# Altium schematic sheet scheme.SchDoc
size A0; Organization: Altium Limited; Address1: L3, 12a Rodborough Rd; Address2: Frenchs Forest; Address3: NSW; Address4: Australia 2086
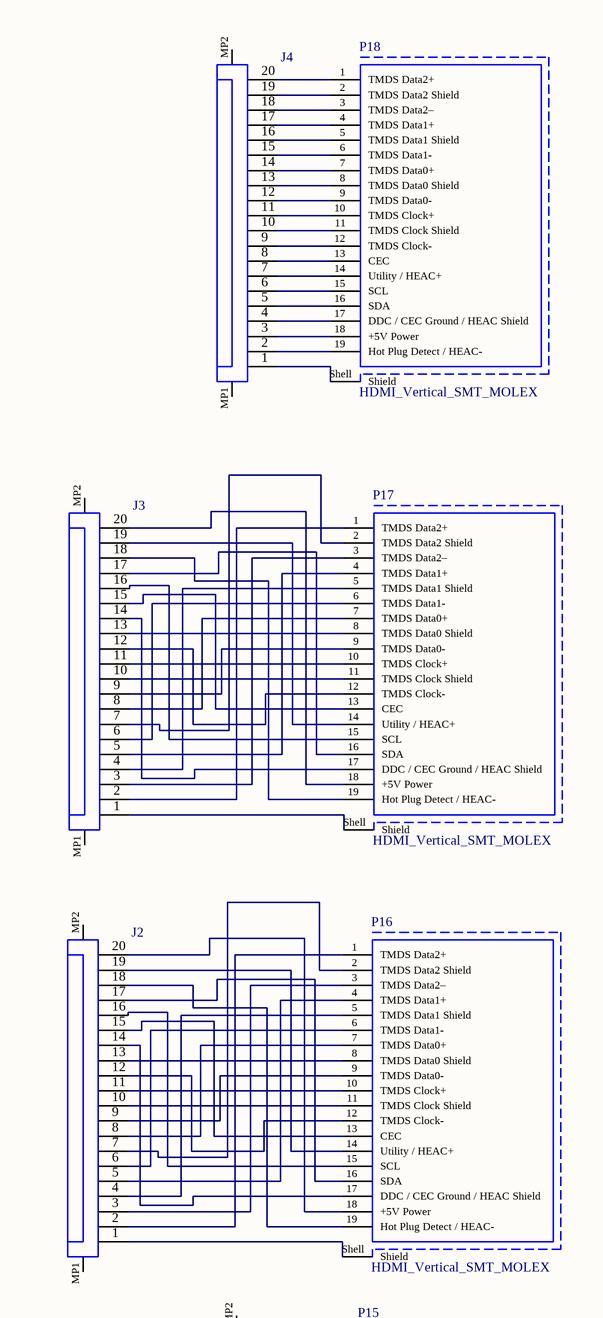
[diagram p0: scheme.SchDoc, top]
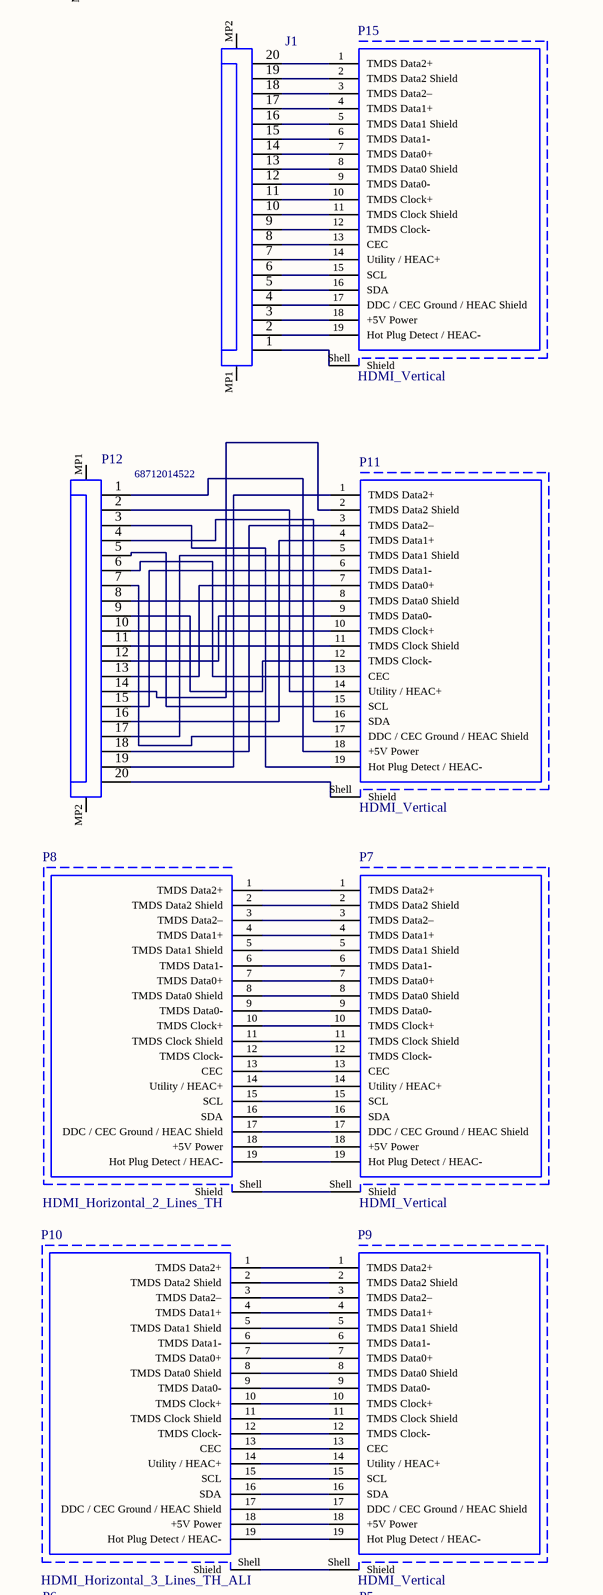
[diagram p1: scheme.SchDoc, centre]
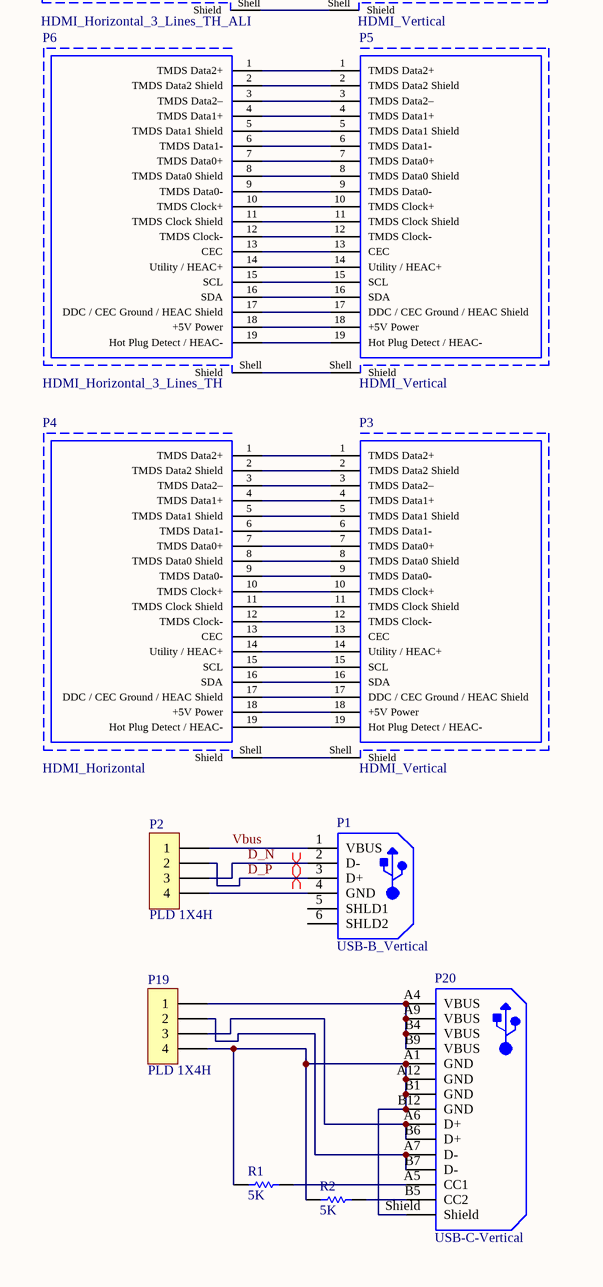
[diagram p2: scheme.SchDoc, bottom]

## Parts
J1  68712014522  [FFC_20pin_0.5mm]  (value not drawn)
J2  68712014522  [FFC_20pin_0.5mm]  (value not drawn)
J3  68712014522  [FFC_20pin_0.5mm]  (value not drawn)
J4  68712014522  [FFC_20pin_0.5mm]  (value not drawn)
P1  USB-B_Vertical  [USB-B_Vertical]
P2  PLD 1X4H  [PLD 1X4H]
P3  HDMI_Vertical  [HDMI Vertical]
P4  HDMI_Horizontal  [HDMI HORIZONTAL]
P5  HDMI_Vertical  [HDMI Vertical]
P6  HDMI_Horizontal_3_Lines_TH  [HDMI HORIZONTAL 3 LINES TH]
P7  HDMI_Vertical  [HDMI Vertical]
P8  HDMI_Horizontal_2_Lines_TH  [HDMI HORIZONTAL 2 LINES TH]
P9  HDMI_Vertical  [HDMI Vertical]
P10  HDMI_Horizontal_3_Lines_TH_ALI  [HDMI HORIZONTAL 3 LINES TH ALI]
P11  HDMI_Vertical  [HDMI Vertical]
P12  68712014522  [68712014522]
P15  HDMI_Vertical  [HDMI Vertical]
P16  HDMI_Vertical_SMT_MOLEX  [HDMI VERTICAL SMT]
P17  HDMI_Vertical_SMT_MOLEX  [HDMI VERTICAL SMT]
P18  HDMI_Vertical_SMT_MOLEX  [HDMI VERTICAL SMT]
P19  PLD 1X4H  [PLD 1X4H]
P20  USB-C-Vertical  [USB-C]
R1  5K  [1206]
R2  5K  [1206]

## Nets
D_N: P1.2(D-) P2.3
D_P: P1.3(D+) P2.2
Vbus: P1.1(VBUS) P2.1
NetJ1_1: J1.1 P15.Shell(Shield)
NetJ1_2: J1.2 P15.19(Hot_Plug_Detect_/_HEAC-)
NetJ1_3: J1.3 P15.18(+5V_Power)
NetJ1_4: J1.4 P15.17(DDC_/_CEC_Ground_/_HEAC_Shield)
NetJ1_5: J1.5 P15.16(SDA)
NetJ1_6: J1.6 P15.15(SCL)
NetJ1_7: J1.7 P15.14(Utility_/_HEAC+)
NetJ1_8: J1.8 P15.13(CEC)
NetJ1_9: J1.9 P15.12(TMDS_Clock-)
NetJ1_10: J1.10 P15.11(TMDS_Clock_Shield)
NetJ1_11: J1.11 P15.10(TMDS_Clock+)
NetJ1_12: J1.12 P15.9(TMDS_Data0-)
NetJ1_13: J1.13 P15.8(TMDS_Data0_Shield)
NetJ1_14: J1.14 P15.7(TMDS_Data0+)
NetJ1_15: J1.15 P15.6(TMDS_Data1-)
NetJ1_16: J1.16 P15.5(TMDS_Data1_Shield)
NetJ1_17: J1.17 P15.4(TMDS_Data1+)
NetJ1_18: J1.18 P15.3(TMDS_Data2–)
NetJ1_19: J1.19 P15.2(TMDS_Data2_Shield)
NetJ1_20: J1.20 P15.1(TMDS_Data2+)
NetJ2_1: J2.1 P16.Shell(Shield)
NetJ2_2: J2.2 P16.1(TMDS_Data2+)
NetJ2_3: J2.3 P16.3(TMDS_Data2–)
NetJ2_4: J2.4 P16.5(TMDS_Data1_Shield)
NetJ2_5: J2.5 P16.4(TMDS_Data1+)
NetJ2_6: J2.6 P16.6(TMDS_Data1-)
NetJ2_7: J2.7 P16.2(TMDS_Data2_Shield)
NetJ2_8: J2.8 P16.7(TMDS_Data0+)
NetJ2_9: J2.9 P16.9(TMDS_Data0-)
NetJ2_10: J2.10 P16.11(TMDS_Clock_Shield)
NetJ2_11: J2.11 P16.10(TMDS_Clock+)
NetJ2_12: J2.12 P16.12(TMDS_Clock-)
NetJ2_13: J2.13 P16.8(TMDS_Data0_Shield)
NetJ2_14: J2.14 P16.17(DDC_/_CEC_Ground_/_HEAC_Shield)
NetJ2_15: J2.15 P16.13(CEC)
NetJ2_16: J2.16 P16.15(SCL)
NetJ2_17: J2.17 P16.16(SDA)
NetJ2_18: J2.18 P16.19(Hot_Plug_Detect_/_HEAC-)
NetJ2_19: J2.19 P16.14(Utility_/_HEAC+)
NetJ2_20: J2.20 P16.18(+5V_Power)
NetJ3_1: J3.1 P17.Shell(Shield)
NetJ3_2: J3.2 P17.1(TMDS_Data2+)
NetJ3_3: J3.3 P17.3(TMDS_Data2–)
NetJ3_4: J3.4 P17.5(TMDS_Data1_Shield)
NetJ3_5: J3.5 P17.4(TMDS_Data1+)
NetJ3_6: J3.6 P17.6(TMDS_Data1-)
NetJ3_7: J3.7 P17.2(TMDS_Data2_Shield)
NetJ3_8: J3.8 P17.7(TMDS_Data0+)
NetJ3_9: J3.9 P17.9(TMDS_Data0-)
NetJ3_10: J3.10 P17.11(TMDS_Clock_Shield)
NetJ3_11: J3.11 P17.10(TMDS_Clock+)
NetJ3_12: J3.12 P17.12(TMDS_Clock-)
NetJ3_13: J3.13 P17.8(TMDS_Data0_Shield)
NetJ3_14: J3.14 P17.17(DDC_/_CEC_Ground_/_HEAC_Shield)
NetJ3_15: J3.15 P17.13(CEC)
NetJ3_16: J3.16 P17.15(SCL)
NetJ3_17: J3.17 P17.16(SDA)
NetJ3_18: J3.18 P17.19(Hot_Plug_Detect_/_HEAC-)
NetJ3_19: J3.19 P17.14(Utility_/_HEAC+)
NetJ3_20: J3.20 P17.18(+5V_Power)
NetJ4_1: J4.1 P18.Shell(Shield)
NetJ4_2: J4.2 P18.19(Hot_Plug_Detect_/_HEAC-)
NetJ4_3: J4.3 P18.18(+5V_Power)
NetJ4_4: J4.4 P18.17(DDC_/_CEC_Ground_/_HEAC_Shield)
NetJ4_5: J4.5 P18.16(SDA)
NetJ4_6: J4.6 P18.15(SCL)
NetJ4_7: J4.7 P18.14(Utility_/_HEAC+)
NetJ4_8: J4.8 P18.13(CEC)
NetJ4_9: J4.9 P18.12(TMDS_Clock-)
NetJ4_10: J4.10 P18.11(TMDS_Clock_Shield)
NetJ4_11: J4.11 P18.10(TMDS_Clock+)
NetJ4_12: J4.12 P18.9(TMDS_Data0-)
NetJ4_13: J4.13 P18.8(TMDS_Data0_Shield)
NetJ4_14: J4.14 P18.7(TMDS_Data0+)
NetJ4_15: J4.15 P18.6(TMDS_Data1-)
NetJ4_16: J4.16 P18.5(TMDS_Data1_Shield)
NetJ4_17: J4.17 P18.4(TMDS_Data1+)
NetJ4_18: J4.18 P18.3(TMDS_Data2–)
NetJ4_19: J4.19 P18.2(TMDS_Data2_Shield)
NetJ4_20: J4.20 P18.1(TMDS_Data2+)
NetP1_4: P1.4(GND) P2.4
NetP3_1: P3.1(TMDS_Data2+) P4.1(TMDS_Data2+)
NetP3_2: P3.2(TMDS_Data2_Shield) P4.2(TMDS_Data2_Shield)
NetP3_3: P3.3(TMDS_Data2–) P4.3(TMDS_Data2–)
NetP3_4: P3.4(TMDS_Data1+) P4.4(TMDS_Data1+)
NetP3_5: P3.5(TMDS_Data1_Shield) P4.5(TMDS_Data1_Shield)
NetP3_6: P3.6(TMDS_Data1-) P4.6(TMDS_Data1-)
NetP3_7: P3.7(TMDS_Data0+) P4.7(TMDS_Data0+)
NetP3_8: P3.8(TMDS_Data0_Shield) P4.8(TMDS_Data0_Shield)
NetP3_9: P3.9(TMDS_Data0-) P4.9(TMDS_Data0-)
NetP3_10: P3.10(TMDS_Clock+) P4.10(TMDS_Clock+)
NetP3_11: P3.11(TMDS_Clock_Shield) P4.11(TMDS_Clock_Shield)
NetP3_12: P3.12(TMDS_Clock-) P4.12(TMDS_Clock-)
NetP3_13: P3.13(CEC) P4.13(CEC)
NetP3_14: P3.14(Utility_/_HEAC+) P4.14(Utility_/_HEAC+)
NetP3_15: P3.15(SCL) P4.15(SCL)
NetP3_16: P3.16(SDA) P4.16(SDA)
NetP3_17: P3.17(DDC_/_CEC_Ground_/_HEAC_Shield) P4.17(DDC_/_CEC_Ground_/_HEAC_Shield)
NetP3_18: P3.18(+5V_Power) P4.18(+5V_Power)
NetP3_19: P3.19(Hot_Plug_Detect_/_HEAC-) P4.19(Hot_Plug_Detect_/_HEAC-)
NetP3_Shell: P3.Shell(Shield) P4.Shell(Shield)
NetP5_1: P5.1(TMDS_Data2+) P6.1(TMDS_Data2+)
NetP5_2: P5.2(TMDS_Data2_Shield) P6.2(TMDS_Data2_Shield)
NetP5_3: P5.3(TMDS_Data2–) P6.3(TMDS_Data2–)
NetP5_4: P5.4(TMDS_Data1+) P6.4(TMDS_Data1+)
NetP5_5: P5.5(TMDS_Data1_Shield) P6.5(TMDS_Data1_Shield)
NetP5_6: P5.6(TMDS_Data1-) P6.6(TMDS_Data1-)
NetP5_7: P5.7(TMDS_Data0+) P6.7(TMDS_Data0+)
NetP5_8: P5.8(TMDS_Data0_Shield) P6.8(TMDS_Data0_Shield)
NetP5_9: P5.9(TMDS_Data0-) P6.9(TMDS_Data0-)
NetP5_10: P5.10(TMDS_Clock+) P6.10(TMDS_Clock+)
NetP5_11: P5.11(TMDS_Clock_Shield) P6.11(TMDS_Clock_Shield)
NetP5_12: P5.12(TMDS_Clock-) P6.12(TMDS_Clock-)
NetP5_13: P5.13(CEC) P6.13(CEC)
NetP5_14: P5.14(Utility_/_HEAC+) P6.14(Utility_/_HEAC+)
NetP5_15: P5.15(SCL) P6.15(SCL)
NetP5_16: P5.16(SDA) P6.16(SDA)
NetP5_17: P5.17(DDC_/_CEC_Ground_/_HEAC_Shield) P6.17(DDC_/_CEC_Ground_/_HEAC_Shield)
NetP5_18: P5.18(+5V_Power) P6.18(+5V_Power)
NetP5_19: P5.19(Hot_Plug_Detect_/_HEAC-) P6.19(Hot_Plug_Detect_/_HEAC-)
NetP5_Shell: P5.Shell(Shield) P6.Shell(Shield)
NetP7_1: P7.1(TMDS_Data2+) P8.1(TMDS_Data2+)
NetP7_2: P7.2(TMDS_Data2_Shield) P8.2(TMDS_Data2_Shield)
NetP7_3: P7.3(TMDS_Data2–) P8.3(TMDS_Data2–)
NetP7_4: P7.4(TMDS_Data1+) P8.4(TMDS_Data1+)
NetP7_5: P7.5(TMDS_Data1_Shield) P8.5(TMDS_Data1_Shield)
NetP7_6: P7.6(TMDS_Data1-) P8.6(TMDS_Data1-)
NetP7_7: P7.7(TMDS_Data0+) P8.7(TMDS_Data0+)
NetP7_8: P7.8(TMDS_Data0_Shield) P8.8(TMDS_Data0_Shield)
NetP7_9: P7.9(TMDS_Data0-) P8.9(TMDS_Data0-)
NetP7_10: P7.10(TMDS_Clock+) P8.10(TMDS_Clock+)
NetP7_11: P7.11(TMDS_Clock_Shield) P8.11(TMDS_Clock_Shield)
NetP7_12: P7.12(TMDS_Clock-) P8.12(TMDS_Clock-)
NetP7_13: P7.13(CEC) P8.13(CEC)
NetP7_14: P7.14(Utility_/_HEAC+) P8.14(Utility_/_HEAC+)
NetP7_15: P7.15(SCL) P8.15(SCL)
NetP7_16: P7.16(SDA) P8.16(SDA)
NetP7_17: P7.17(DDC_/_CEC_Ground_/_HEAC_Shield) P8.17(DDC_/_CEC_Ground_/_HEAC_Shield)
NetP7_18: P7.18(+5V_Power) P8.18(+5V_Power)
NetP7_19: P7.19(Hot_Plug_Detect_/_HEAC-) P8.19(Hot_Plug_Detect_/_HEAC-)
NetP7_Shell: P7.Shell(Shield) P8.Shell(Shield)
NetP9_1: P9.1(TMDS_Data2+) P10.1(TMDS_Data2+)
NetP9_2: P9.2(TMDS_Data2_Shield) P10.2(TMDS_Data2_Shield)
NetP9_3: P9.3(TMDS_Data2–) P10.3(TMDS_Data2–)
NetP9_4: P9.4(TMDS_Data1+) P10.4(TMDS_Data1+)
NetP9_5: P9.5(TMDS_Data1_Shield) P10.5(TMDS_Data1_Shield)
NetP9_6: P9.6(TMDS_Data1-) P10.6(TMDS_Data1-)
NetP9_7: P9.7(TMDS_Data0+) P10.7(TMDS_Data0+)
NetP9_8: P9.8(TMDS_Data0_Shield) P10.8(TMDS_Data0_Shield)
NetP9_9: P9.9(TMDS_Data0-) P10.9(TMDS_Data0-)
NetP9_10: P9.10(TMDS_Clock+) P10.10(TMDS_Clock+)
NetP9_11: P9.11(TMDS_Clock_Shield) P10.11(TMDS_Clock_Shield)
NetP9_12: P9.12(TMDS_Clock-) P10.12(TMDS_Clock-)
NetP9_13: P9.13(CEC) P10.13(CEC)
NetP9_14: P9.14(Utility_/_HEAC+) P10.14(Utility_/_HEAC+)
NetP9_15: P9.15(SCL) P10.15(SCL)
NetP9_16: P9.16(SDA) P10.16(SDA)
NetP9_17: P9.17(DDC_/_CEC_Ground_/_HEAC_Shield) P10.17(DDC_/_CEC_Ground_/_HEAC_Shield)
NetP9_18: P9.18(+5V_Power) P10.18(+5V_Power)
NetP9_19: P9.19(Hot_Plug_Detect_/_HEAC-) P10.19(Hot_Plug_Detect_/_HEAC-)
NetP9_Shell: P9.Shell(Shield) P10.Shell(Shield)
NetP11_1: P11.1(TMDS_Data2+) P12.19
NetP11_2: P11.2(TMDS_Data2_Shield) P12.14
NetP11_3: P11.3(TMDS_Data2–) P12.18
NetP11_4: P11.4(TMDS_Data1+) P12.16
NetP11_5: P11.5(TMDS_Data1_Shield) P12.17
NetP11_6: P11.6(TMDS_Data1-) P12.15
NetP11_7: P11.7(TMDS_Data0+) P12.13
NetP11_8: P11.8(TMDS_Data0_Shield) P12.8
NetP11_9: P11.9(TMDS_Data0-) P12.12
NetP11_10: P11.10(TMDS_Clock+) P12.10
NetP11_11: P11.11(TMDS_Clock_Shield) P12.11
NetP11_12: P11.12(TMDS_Clock-) P12.9
NetP11_13: P11.13(CEC) P12.6
NetP11_14: P11.14(Utility_/_HEAC+) P12.2
NetP11_15: P11.15(SCL) P12.5
NetP11_16: P11.16(SDA) P12.4
NetP11_17: P11.17(DDC_/_CEC_Ground_/_HEAC_Shield) P12.7
NetP11_18: P11.18(+5V_Power) P12.1
NetP11_19: P11.19(Hot_Plug_Detect_/_HEAC-) P12.3
NetP11_Shell: P11.Shell(Shield) P12.20
NetP19_1: P19.1 P20.A4(VBUS) P20.A9(VBUS) P20.B4(VBUS) P20.B9(VBUS)
NetP19_2: P19.2 P20.A7(D-) P20.B7(D-)
NetP19_3: P19.3 P20.A6(D+) P20.B6(D+)
NetP19_4: P19.4 P20.A1(GND) P20.A12(GND) P20.B1(GND) P20.B12(GND) P20.Shield R1.1 R2.1
NetP20_A5: P20.A5(CC1) R1.2
NetP20_B5: P20.B5(CC2) R2.2

Not connected (* = marked no-connect by the designer): J1 MP1 MP2; J2 MP1 MP2; J3 MP1 MP2; J4 MP1 MP2; P1 5(SHLD1) 6(SHLD2); P12 MP1 MP2

## Layout directives
differential pair: D_N, D_P

## Notes on the sheet
- Title
- Size:
- Date:
- File:
- A0
- Number:
- Time:
- Revision:
- Sheet
- of

## Library data of the parts
J1-J4 = FFC 20 pin: SMT ZIF Connectors WR-FPC, Horizontal, Bottom Contact, pitch 0.5 mm, 20 pins; Manufacturer: Wurth Elektronik; Pin Number: 20; Working Voltage: 50VAC; Withstanding Voltage: 250VAC; Rated Current: 0.5A; Contact Resistance: 20mOhm; Pitch: 0.5mm; Publisher: WurthElektronik; Manufacturer URL: http://www.we-online.de; Contact Design: BottomContact; Datasheet URL: https://katalog.we-online.de/em/datasheet/68712014522.pdf; Package Reference: 68712014522; Orientation: Horizontal; Packaging: TapeandReel; Operating Temperature: -25to85degC; Mounting Technology: SMT; Part Number: 68712014522
P2 P19 = PLD 1X4H: Header, 4-Pin, SIngle row, Right Angle
P12 = CMP-1502-01535-1: SMT ZIF Connectors WR-FPC, Horizontal, Bottom Contact, pitch 0.5 mm, 20 pins; Manufacturer: Wurth Elektronik; Pin Number: 20; Working Voltage: 50VAC; Withstanding Voltage: 250VAC; Rated Current: 0.5A; Contact Resistance: 20mOhm; Pitch: 0.5mm; Publisher: WurthElektronik; Manufacturer URL: http://www.we-online.de; Contact Design: BottomContact; Datasheet URL: https://katalog.we-online.de/em/datasheet/68712014522.pdf; Package Reference: 68712014522; Orientation: Horizontal; Packaging: TapeandReel; Operating Temperature: -25to85degC; Mounting Technology: SMT; Part Number: 68712014522
R1 R2 = Resistor: Resistor 1206; LCSC Part #: *